# Altium schematic sheet Equalizer.SchDoc
size A; DocumentNumber: 3; SheetNumber: 3; SheetTotal: 3; PageSetup: Record=PageOptions|CenterHorizontal=True|CenterVertical=True|PrintScale=0.68|XCorrection=1.00|YCorrection=1.00|PrintKind=1|BorderSize=5000000|LeftOffset=0|BottomOffset=0|Orientation=2|PaperLength=1000|PaperWidth=1000|Scale=100|PaperSource=15|PrintQuality=1200|MediaType=1|DitherType=10|PaperKind=Letter|PrintScaleMode=1
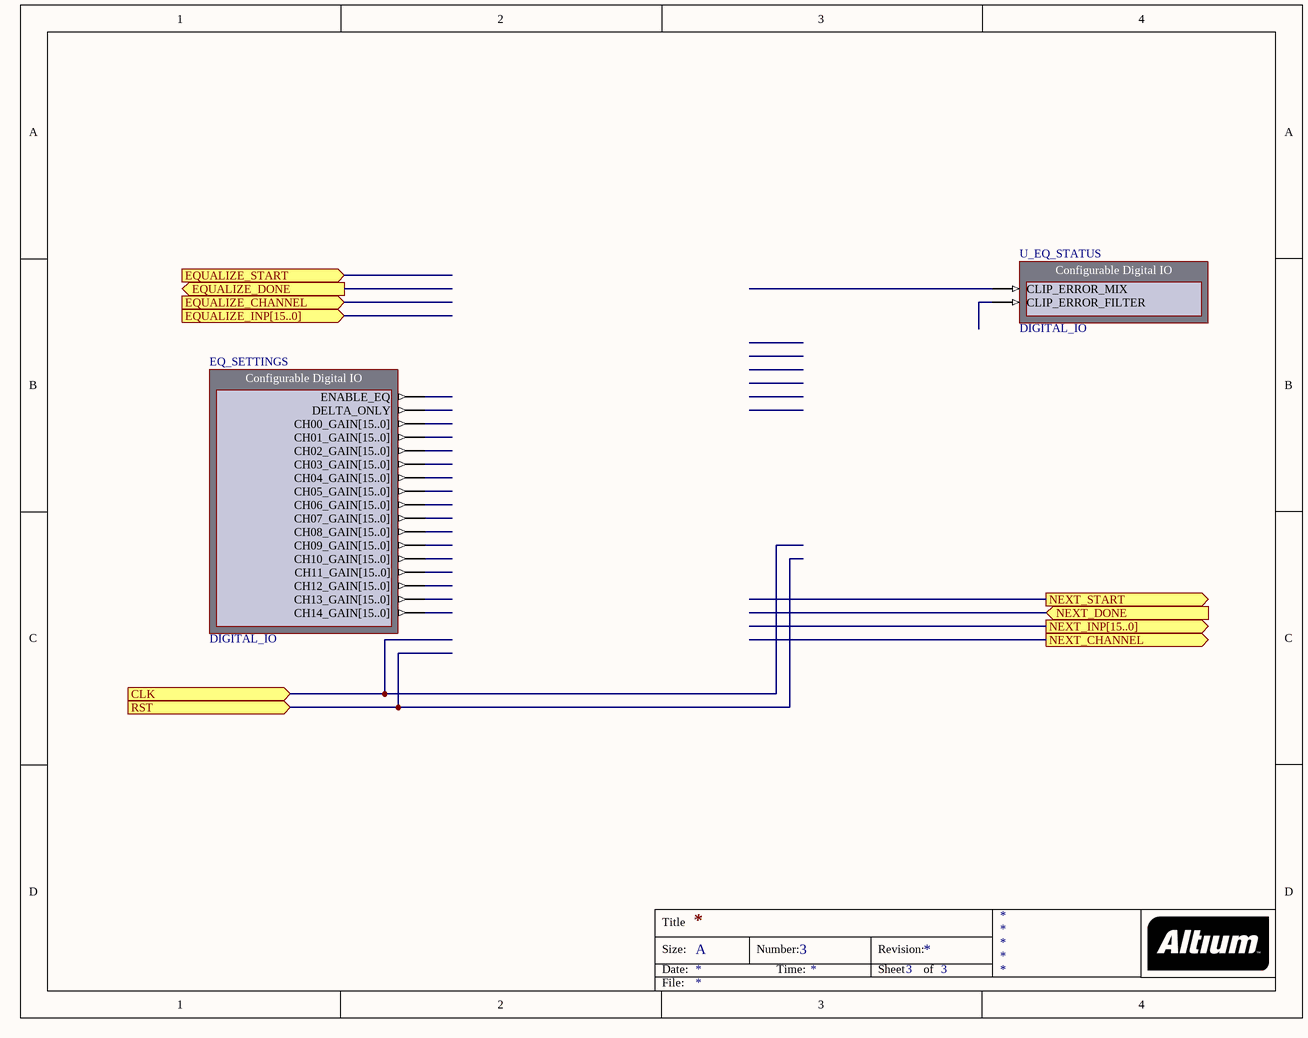
[diagram p0: Equalizer.SchDoc]

## Parts
EQ_SETTINGS  DIGITAL_IO
U_EQ_STATUS  DIGITAL_IO

## Ports
CLK (in), EQUALIZE_CHANNEL (in), EQUALIZE_DONE (out), EQUALIZE_INP[15..0] (in), EQUALIZE_START (in), NEXT_CHANNEL (out), NEXT_DONE (in), NEXT_INP[15..0] (out), NEXT_START (out), RST (in)

## Nets

Not connected (* = marked no-connect by the designer): EQ_SETTINGS CH00_GAIN[15..0] CH01_GAIN[15..0] CH02_GAIN[15..0] CH03_GAIN[15..0] CH04_GAIN[15..0] CH05_GAIN[15..0] CH06_GAIN[15..0] CH07_GAIN[15..0] CH08_GAIN[15..0] CH09_GAIN[15..0] CH10_GAIN[15..0] CH11_GAIN[15..0] CH12_GAIN[15..0] CH13_GAIN[15..0] CH14_GAIN[15..0] DELTA_ONLY ENABLE_EQ; U_EQ_STATUS CLIP_ERROR_FILTER CLIP_ERROR_MIX

## Notes on the sheet
- Title
- Size:
- Date:
- A
- Number:
- Time:
- Revision:
- Sheet
- of
- File:

## Library data of the parts
EQ_SETTINGS = DIGITAL_IO: Configurable Digital IO; NEXUS_CORE: Instrument; NEXUS_JTAG_DEVICE: True; NEXUS_JTAG_ORDER: 0; ConfigurationParameters: {}Version[2,0]{}StorageType[3]{}InterfaceType[Parallel]{}SchCompWidth[140]{}NoInputs[ ]{}Output0Name[ENABLE_EQ]{}Output0Width[1]{}Output0InitValue[1]{}Output0Kind[Numeric]{}Output0NumRadix[Binary]{}Output1Name[DELTA_ONLY]{}Output1Width[1]{}Output1InitValue[0]{}Output1Kind[Numeric]{}Output1NumRadix[Binary]{}Output2Name[CH00_GAIN{1}15..0{2}]{}Output2Width[16]{}Output2InitValue[4096]{}Output2Kind[Numeric]{}Output2NumRadix[Binary]{}Output3Name[CH01_GAIN{1}15..0{2}]{}Output3Width[16]{}Output3InitValue[4096]{}Output3Kind[Numeric]{}Output3NumRadix[Binary]{}Output4Name[CH02_GAIN{1}15..0{2}]{}Output4Width[16]{}Output4InitValue[4096]{}Output4Kind[Numeric]{}Output4NumRadix[Binary]{}Output5Name[CH03_GAIN{1}15..0{2}]{}Output5Width[16]{}Output5InitValue[4096]{}Output5Kind[Numeric]{}Output5NumRadix[Binary]{}Output6Name[CH04_GAIN{1}15..0{2}]{}Output6Width[16]{}Output6InitValue[0]{}Output6Kind[Numeric]{}Output6NumRadix[Binary]{}Output7Name[CH05_GAIN{1}15..0{2}]{}Output7Width[16]{}Output7InitValue[0]{}Output7Kind[Numeric]{}Output7NumRadix[Binary]{}Output8Name[CH06_GAIN{1}15..0{2}]{}Output8Width[16]{}Output8InitValue[0]{}Output8Kind[Numeric]{}Output8NumRadix[Binary]{}Output9Name[CH07_GAIN{1}15..0{2}]{}Output9Width[16]{}Output9InitValue[0]{}Output9Kind[Numeric]{}Output9NumRadix[Binary]{}Output10Name[CH08_GAIN{1}15..0{2}]{}Output10Width[16]{}Output10InitValue[0]{}Output10Kind[Numeric]{}Output10NumRadix[Binary]{}Output11Name[CH09_GAIN{1}15..0{2}]{}Output11Width[16]{}Output11InitValue[0]{}Output11Kind[Numeric]{}Output11NumRadix[Binary]{}Output12Name[CH10_GAIN{1}15..0{2}]{}Output12Width[16]{}Output12InitValue[0]{}Output12Kind[Numeric]{}Output12NumRadix[Binary]{}Output13Name[CH11_GAIN{1}15..0{2}]{}Output13Width[16]{}Output13InitValue[0]{}Output13Kind[Numeric]{}Output13NumRadix[Binary]{}Output14Name[CH12_GAIN{1}15..0{2}]{}Output14Width[16]{}Output14InitValue[0]{}Output14Kind[Numeric]{}Output14NumRadix[Binary]{}Output15Name[CH13_GAIN{1}15..0{2}]{}Output15Width[16]{}Output15InitValue[0]{}Output15Kind[Numeric]{}Output15NumRadix[Binary]{}Output16Name[CH14_GAIN{1}15..0{2}]{}Output16Width[16]{}Output16InitValue[0]{}Output16Kind[Numeric]{}Output16NumRadix[Binary]{}Designator[EQ_SETTINGS]{}InternalID[3]{}; ConfiguratorName: DIGITAL_IO; ComponentLink1Description: Core &Resource Usage; ComponentLink1URL: CR0134 FPGA Instrument Resource Usage.pdf; Core Revision: 1.00.00; HelpURL: CR0179 DIGITAL_IO Configurable Digital IO Module.pdf; LastRevisionNo: 1.00.00; Published: 28-Jun-2007; Publisher: Altium Limited; UseInDSF: True
U_EQ_STATUS = DIGITAL_IO: Configurable Digital IO; NEXUS_CORE: Instrument; NEXUS_JTAG_DEVICE: True; NEXUS_JTAG_ORDER: 0; ConfigurationParameters: {}Version[2,0]{}StorageType[3]{}InterfaceType[Parallel]{}SchCompWidth[140]{}Input0Name[CLIP_ERROR_MIX]{}Input0Width[1]{}Input0InitValue[0]{}Input0Kind[LEDs]{}Input0LEDStyle[Red]{}Input1Name[CLIP_ERROR_FILTER]{}Input1Width[1]{}Input1InitValue[0]{}Input1Kind[LEDs]{}Input1LEDStyle[Red]{}NoOutputs[ ]{}Designator[U_EQ_STATUS]{}InternalID[4]{}; ConfiguratorName: DIGITAL_IO; ComponentLink1Description: Core &Resource Usage; ComponentLink1URL: CR0134 FPGA Instrument Resource Usage.pdf; Core Revision: 1.00.00; HelpURL: CR0179 DIGITAL_IO Configurable Digital IO Module.pdf; LastRevisionNo: 1.00.00; Published: 28-Jun-2007; Publisher: Altium Limited; UseInDSF: True